# Altium schematic sheet UBX_NORA_B1_SCHEM_0002_Power.SchDoc
size A3; Date: 7/24/2020; CompanyName: U-blox; DrawnBy: EMOO; Engineer: EMOO; Organization: U-blox; Address1: 3950 Fairview Industrial Dr SE #100; Address2: Salem, OR 97302; SheetNumber: 2; SheetTotal: 6; SheetSize: B; SheetTitle: Power
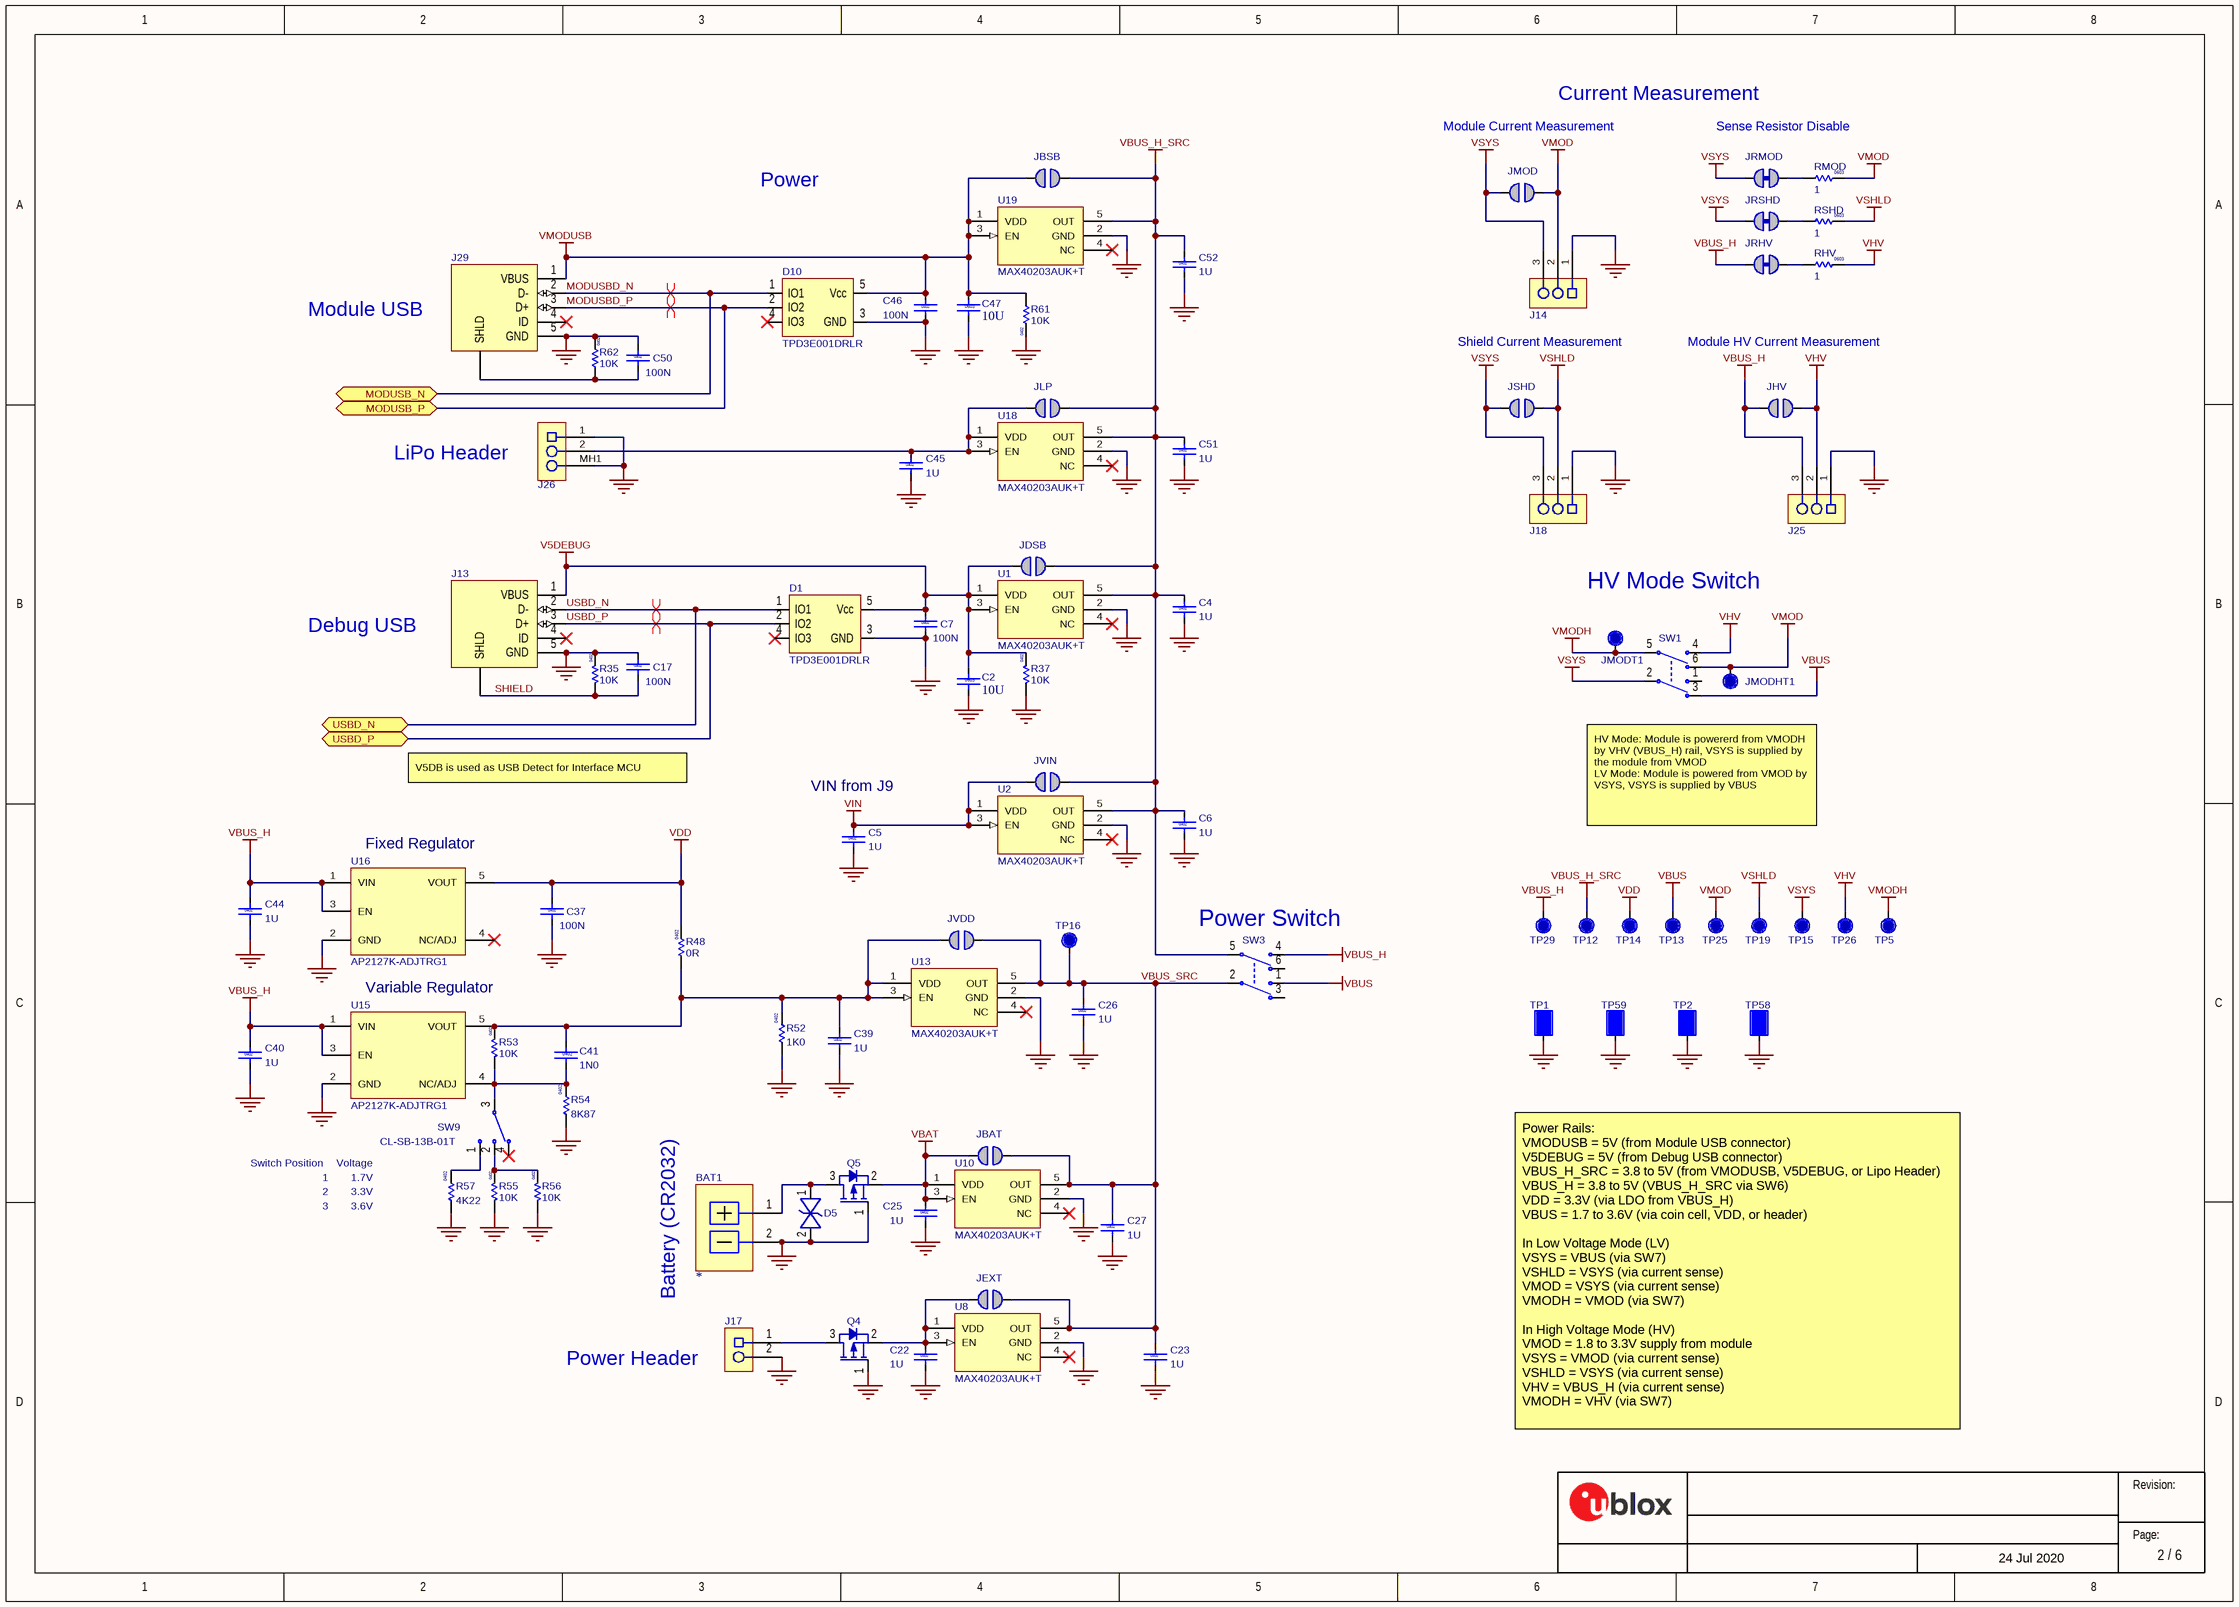
[diagram p0: UBX_NORA_B1_SCHEM_0002_Power.SchDoc]

## Parts
BAT1  (no value)  [Battery_S8211-46R_large]
C2  value 10U  Size: 0603  [CAP 0603 HD]
C4  value 1U  Size: 0402  [Cap 0402 HD]
C5  value 1U  Size: 0402  [Cap 0402 HD]
C6  value 1U  Size: 0402  [Cap 0402 HD]
C7  value 100N  Size: 0402  [Cap 0402 HD]
C17  value 100N  Size: 0402  [Cap 0402 HD]
C22  value 1U  Size: 0402  [Cap 0402 HD]
C23  value 1U  Size: 0402  [Cap 0402 HD]
C25  value 1U  Size: 0402  [Cap 0402 HD]
C26  value 1U  Size: 0402  [Cap 0402 HD]
C27  value 1U  Size: 0402  [Cap 0402 HD]
C37  value 100N  Size: 0402  [Cap 0402 HD]
C39  value 1U  Size: 0402  [Cap 0402 HD]
C40  value 1U  Size: 0402  [Cap 0402 HD]
C41  value 1N0  Size: 0402  [Cap 0402 HD]
C44  value 1U  Size: 0402  [Cap 0402 HD]
C45  value 1U  Size: 0402  [Cap 0402 HD]
C46  value 100N  Size: 0402  [Cap 0402 HD]
C47  value 10U  Size: 0603  [CAP 0603 HD]
C50  value 100N  Size: 0402  [Cap 0402 HD]
C51  value 1U  Size: 0402  [Cap 0402 HD]
C52  value 1U  Size: 0402  [Cap 0402 HD]
D1  Manufacturer P/N: TPD3E001DRLR  [SOT-553]
D5  (no value)  [SOD-923]
D10  Manufacturer P/N: TPD3E001DRLR  [SOT-553]
J13  (no value)  [USB_MICRO_RA_W-2TABS]
J14  (no value)  [HDR-0.1P-3Pin-1Row-SMT]
J17  (no value)  [HDR-0.1P-2PIN-TH]
J18  (no value)  [HDR-0.1P-3Pin-1Row-SMT]
J25  (no value)  [HDR-0.1P-3Pin-1Row-SMT]
J26  (no value)  [B2B-PH-SM4-TB]
J29  (no value)  [USB_MICRO_RA_W-2TABS]
JBAT  (no value)  [Solderbridge-Open]  (no BOM)
JBSB  (no value)  [Solderbridge-Open]  (no BOM)
JDSB  (no value)  [Solderbridge-Open]  (no BOM)
JEXT  (no value)  [Solderbridge-Open]  (no BOM)
JHV  (no value)  [Solderbridge-Open]  (no BOM)
JLP  (no value)  [Solderbridge-Open]  (no BOM)
JMOD  (no value)  [Solderbridge-Open]  (no BOM)
JMODHT1  TP  [TP10R]  (value not drawn)  (no BOM)
JMODT1  TP  [TP10R]  (value not drawn)  (no BOM)
JRHV  (no value)  [Solderbridge-Short]  (net tie, no BOM)
JRMOD  (no value)  [Solderbridge-Short]  (net tie, no BOM)
JRSHD  (no value)  [Solderbridge-Short]  (net tie, no BOM)
JSHD  (no value)  [Solderbridge-Open]  (no BOM)
JVDD  (no value)  [Solderbridge-Open]  (no BOM)
JVIN  (no value)  [Solderbridge-Open]  (no BOM)
Q4  (no value)  [SOT-523]
Q5  (no value)  [SOT-523]
R35  value 10K  Size: 0402  [RES 0402 HD]
R37  value 10K  Size: 0402  [RES 0402 HD]
R48  value 0R  Size: 0402  [RES 0402 HD]
R52  value 1K0  Size: 0402  [RES 0402 HD]
R53  value 10K  Size: 0402  [RES 0402 HD]
R54  value 8K87  Size: 0402  [RES 0402 HD]
R55  value 10K  Size: 0402  [RES 0402 HD]
R56  value 10K  Size: 0402  [RES 0402 HD]
R57  value 4K22  Size: 0402  [RES 0402 HD]
R61  value 10K  Size: 0402  [RES 0402 HD]
R62  value 10K  Size: 0402  [RES 0402 HD]
RHV  value 1  Size: 0603  [RES_0603_1700Lx950Wx600H_600x1000Pad_800G_FLX]
RMOD  value 1  Size: 0603  [RES_0603_1700Lx950Wx600H_600x1000Pad_800G_FLX]
RSHD  value 1  Size: 0603  [RES_0603_1700Lx950Wx600H_600x1000Pad_800G_FLX]
SW1  (no value)  [SW_Slide_DPDT_JS202011SCQN]
SW3  (no value)  [SW_Slide_DPDT_JS202011SCQN]
SW9  UBXH19-0000039  [CL-SB-13B-01T]  (value not drawn)
TP1  (no value)  [TP4.5x3Sq]  (no BOM)
TP2  (no value)  [TP4.5x3Sq]  (no BOM)
TP5  TP  [TP12R]  (value not drawn)  (no BOM)
TP12  TP  [TP12R]  (value not drawn)  (no BOM)
TP13  TP  [TP12R]  (value not drawn)  (no BOM)
TP14  TP  [TP12R]  (value not drawn)  (no BOM)
TP15  TP  [TP12R]  (value not drawn)
TP16  TP  [TP10R]  (value not drawn)  (no BOM)
TP19  TP  [TP12R]  (value not drawn)  (no BOM)
TP25  TP  [TP12R]  (value not drawn)  (no BOM)
TP26  TP  [TP12R]  (value not drawn)  (no BOM)
TP29  TP  [TP12R]  (value not drawn)  (no BOM)
TP58  (no value)  [TP4.5x3Sq]  (no BOM)
TP59  (no value)  [TP4.5x3Sq]  (no BOM)
U1  Manufacturer Part Number 1: MAX40203AUK+T  [SOT-23-5_2]
U2  Manufacturer Part Number 1: MAX40203AUK+T  [SOT-23-5_2]
U8  Manufacturer Part Number 1: MAX40203AUK+T  [SOT-23-5_2]
U10  Manufacturer Part Number 1: MAX40203AUK+T  [SOT-23-5_2]
U13  Manufacturer Part Number 1: MAX40203AUK+T  [SOT-23-5_2]
U15  Manufacturer Part Number 1: AP2127K-ADJTRG1  [SOT-23-5_3D_Body_Fix]  (hidden comment: UBXH12-0000547)
U16  Manufacturer Part Number 1: AP2127K-ADJTRG1  [SOT-23-5_3D_Body_Fix]  (hidden comment: UBXH12-0000546)
U18  Manufacturer Part Number 1: MAX40203AUK+T  [SOT-23-5_2]
U19  Manufacturer Part Number 1: MAX40203AUK+T  [SOT-23-5_2]

## Ports
MODUSB_N (bidir), MODUSB_P (bidir), USBD_N (bidir), USBD_P (bidir)

## Nets
GND: BAT1.2 C2.2 C4.2 C5.2 C6.2 C7.2 C17.1 C22.2 C23.2 C25.2 C26.2 C27.2 C37.2 C39.2 C40.2 C44.2 C45.2 C46.2 C47.2 C50.1 C51.2 C52.2 D1.3(GND) D5.2 D10.3(GND) J13.5(GND) J14.1 J17.2 J18.1 J25.1 J26.1 J26.MH1 J29.5(GND) Q4.1(G) Q5.1(G) R35.2 R37.1 R52.1 R54.1 R55.1 R56.1 R57.1 R61.2 R62.2 TP1.1 TP2.1 TP58.1 TP59.1 U1.2(GND) U2.2(GND) U8.2(GND) U10.2(GND) U13.2(GND) U15.2(GND) U16.2(GND) U18.2(GND) U19.2(GND)
V5DEBUG: C2.1 C7.1 D1.5(Vcc) J13.1(VBUS) JDSB.2 R37.2 U1.1(VDD) U1.3(EN)
VBAT: C25.1 JBAT.2 Q5.2(S) U10.1(VDD) U10.3(EN)
VBUS: SW1.3(N.C-1) SW3.1(N.O-1) TP13.1
VBUS_H: C40.1 C44.1 J25.3 JHV.2 JRHV.2 SW3.4(N.O-2) TP29.1 U15.1(VIN) U15.3(EN) U16.1(VIN) U16.3(EN)
VBUS_H_SRC: C4.1 C6.1 C51.1 C52.1 JBSB.1 JDSB.1 JLP.1 JVIN.1 SW3.5(COM-2) TP12.1 U1.5(OUT) U2.5(OUT) U18.5(OUT) U19.5(OUT)
VDD: C37.1 R48.2 TP14.1 U16.5(VOUT)
VHV: J25.2 JHV.1 RHV.2 SW1.4(N.O-2) TP26.1
VIN: C5.1 JVIN.2 U2.1(VDD) U2.3(EN)
VMOD: J14.2 JMOD.1 JMODHT1.1 RMOD.2 SW1.6(N.C-2) TP25.1
VMODH: JMODT1.1 SW1.5(COM-2) TP5.1
VMODUSB: C46.1 C47.1 D10.5(Vcc) J29.1(VBUS) JBSB.2 R61.1 U19.1(VDD) U19.3(EN)
VSHLD: J18.2 JSHD.1 RSHD.2 TP19.1
VSYS: J14.3 J18.3 JMOD.2 JRMOD.2 JRSHD.2 JSHD.2 SW1.2(COM-1) TP15.1
MODUSBD_N: D10.1(IO1) J29.2(D-) ; port MODUSB_N
MODUSBD_P: D10.2(IO2) J29.3(D+) ; port MODUSB_P
SHIELD: C17.2 J13.6(SHLD) R35.1
USBD_N: D1.1(IO1) J13.2(D-) ; port USBD_N
USBD_P: D1.2(IO2) J13.3(D+) ; port USBD_P
VBUS_SRC: C23.1 C26.1 C27.1 JBAT.1 JEXT.1 JVDD.1 SW3.2(COM-1) TP16.1 U8.5(OUT) U10.5(OUT) U13.5(OUT)
NetBAT1_1: BAT1.1 D5.1 Q5.3(D)
NetC22_1: C22.1 JEXT.2 Q4.2(S) U8.1(VDD) U8.3(EN)
NetC39_1: C39.1 C41.1 JVDD.2 R48.1 R52.2 R53.2 U13.1(VDD) U13.3(EN) U15.5(VOUT)
NetC41_2: C41.2 R53.1 R54.2 SW9.3(COM) U15.4(NC/ADJ)
NetC45_1: C45.1 J26.2 JLP.2 U18.1(VDD) U18.3(EN)
NetC50_2: C50.2 J29.6(SHLD) R62.1
NetJ17_1: J17.1 Q4.3(D)
NetJRHV_1: JRHV.1 RHV.1
NetJRMOD_1: JRMOD.1 RMOD.1
NetJRSHD_1: JRSHD.1 RSHD.1
NetR55_2: R55.2 R56.2 SW9.2(N.O-2)
NetR57_2: R57.2 SW9.1(N.O-1)

Not connected (* = marked no-connect by the designer): D1 4(IO3)*; D10 4(IO3)*; J13 4(ID)*; J29 4(ID)*; SW1 1(N.O-1); SW3 3(N.C-1) 6(N.C-2); SW9 4(N.O.-3)*; U1 4(NC)*; U2 4(NC)*; U8 4(NC)*; U10 4(NC)*; U13 4(NC)*; U16 4(NC/ADJ)*; U18 4(NC)*; U19 4(NC)*

## Layout directives
differential pair; net class USB_DIFF: MODUSBD_N, MODUSBD_P, USBD_N, USBD_P

## Notes on the sheet
- Current Measurement
- Power
- Module Current Measurement
- Sense Resistor Disable
- Module USB
- Shield Current Measurement
- Module HV Current Measurement
- LiPo Header
- HV Mode Switch
- Debug USB
- V5DB is used as USB Detect for Interface MCU
- (near C5) VIN from J9
- HV Mode: Module is powererd from VMODH by VHV (VBUS_H) rail, VSYS is supplied by the module from VMOD
  LV Mode: Module is powered from VMOD by VSYS, VSYS is supplied by VBUS
- (near U16) Fixed Regulator
- (near SW3) Power Switch
- Variable Regulator
- Switch Position
- 1
- 2
- Voltage
- 1.7V
- 3.3V
- 3
- 3.6V
- Battery (CR2032)
- Power Header
- Power Rails:
  VMODUSB = 5V (from Module USB connector)
  V5DEBUG = 5V (from Debug USB connector)
  VBUS_H_SRC = 3.8 to 5V (from VMODUSB, V5DEBUG, or Lipo Header)
  VBUS_H = 3.8 to 5V (VBUS_H_SRC via SW6)
  VDD = 3.3V (via LDO from VBUS_H)
  VBUS = 1.7 to 3.6V (via coin cell, VDD, or header)
  In Low Voltage Mode (LV)
  VSYS = VBUS (via SW7)
  VSHLD = VSYS (via current sense)
  VMOD = VSYS (via current sense)
  VMODH = VMOD (via SW7)
  In High Voltage Mode (HV)
  VMOD = 1.8 to 3.3V supply from module
  VSYS = VMOD (via current sense)
  VSHLD = VSYS (via current sense)
  VHV = VBUS_H (via current sense)
  VMODH = VHV (via SW7)
- 24 Jul 2020
- Revision:
- Page:

## Library data of the parts
BAT1 = UBXH03-0000010: BATTERY HOLDER COIN SMT CR2016 CR2020 CR2025 CR2032 HARWIN S8211-46R; Editor: eric.moog; Env: ROHS; Permitted Use: Support Products; Perferred: PREF; Manufacturer P/N: *; Part Number: UBXH03-0000010; Min Operating Temp: -40°C; Max Operating Temp: 105°C; Part Type: Battery; UBX Wiki: https://wiki.u-blox.com/bin/view/Operations/PartDetails?index=38906; RefDes: BT
C2 C47 = UBXH01-0000040: CAP CER X5R 0603 10U 20% 10V; Manufacturer: Taiyo Yuden Company, Ltd.; Manufacturer P/N: LMK107BBJ106MALT; Editor: pierpaolo.arban; Released by: matej.budin; Env: ROHS; Permitted Use: Volume Products; Perferred: PREF; Mfg P/N Status: Active; Mfg P/N Split: 100; Mfg P/N Released: Yes; Part Number: UBXH01-0000040; Tolerance: 20%; Max Voltage: 10V; Part Type: Capacitor; Release Data: 2013-01-10T11:54:39; UBX Wiki: https://wiki.u-blox.com/bin/view/Operations/PartDetails?index=16909; RefDes: C; Mfg P/N Datasheet: https://wiki.u-blox.com/bin/view/Generic/Docs/DocumentSummary?index=16905; Manufacturer 2: Murata Manufacturing Company, Ltd.; Manufacturer P/N 2: GRM188R61A106KAAL; Mfg P/N Status 2: Active; Mfg P/N Split 2: 0; Mfg P/N Released 2: Yes; Mfg P/N Datasheet 2: https://wiki.u-blox.com/bin/view/Generic/Docs/DocumentSummary?index=27232; Manufacturer 3: Taiyo Yuden Company, Ltd.; Manufacturer P/N 3: LMK107BJ106MALTD; Mfg P/N Status 3: NRND; Mfg P/N Split 3: 0; Mfg P/N Released 3: Yes; Mfg P/N Datasheet 3: https://wiki.u-blox.com/bin/view/Generic/Docs/DocumentSummary?index=29392
C4-C6 C22 C23 C25-C27 C39 C40 C44 C45 C51 C52 = UBXH01-0000248: CAP CER X5R 0402 1U 10% 10V; Manufacturer: Murata Manufacturing Company, Ltd.; Manufacturer P/N: GRM155R61C105KA12; Editor: michael.hein; Released by: igor.shevchenko; Env: ROHS; Permitted Use: Volume Products; Perferred: PREF; Mfg P/N Status: Active; Mfg P/N Split: 100; Mfg P/N Released: Yes; Part Number: UBXH01-0000248; Tolerance: 10%; Max Voltage: 10V; Min Operating Temp: -40°C; Max Operating Temp: 85°C; Part Type: Capacitor; Release Data: 2016-03-16T11:26:35; UBX Wiki: https://wiki.u-blox.com/bin/view/Operations/PartDetails?index=24378; RefDes: C; Mfg P/N Datasheet: https://wiki.u-blox.com/bin/view/Generic/Docs/DocumentSummary?index=29581; Manufacturer 2: TDK Corporation; Manufacturer P/N 2: C1005X5R1E105K050BC; Mfg P/N Status 2: Active; Mfg P/N Split 2: 0; Mfg P/N Released 2: Yes; Mfg P/N Datasheet 2: https://wiki.u-blox.com/bin/view/Generic/Docs/DocumentSummary?index=28058; Manufacturer 3: Samsung Electro-Mechanics; Manufacturer P/N 3: CL05A105KA5NQNC; Mfg P/N Status 3: Active; Mfg P/N Split 3: 0; Mfg P/N Released 3: Yes; Mfg P/N Datasheet 3: https://wiki.u-blox.com/bin/view/Generic/Docs/DocumentSummary?index=28056
C7 C17 C37 C46 C50 = UBXH01-2021002: CAP CER X5R 0402 100N 10% 10V; Manufacturer: Murata Manufacturing Company, Ltd.; Manufacturer P/N: GRM155R61A104KA01; Editor: roland.rust; Env: GREEN; Permitted Use: Volume Products; Perferred: PREF; Mfg P/N Status: NRND; Mfg P/N Split: 100; Mfg P/N Released: Yes; Part Number: UBXH01-2021002; Tolerance: 10%; Max Voltage: 10V; Part Type: Capacitor; Released by: roland.rust; Release Data: 2005-07-22T13:59:44; UBX Wiki: https://wiki.u-blox.com/bin/view/Operations/PartDetails?index=5759; RefDes: C; Manufacturer 2: Samsung Electro-Mechanics; Manufacturer P/N 2: CL05A104KP5NNN; Mfg P/N Status 2: Active; Mfg P/N Split 2: 0; Mfg P/N Released 2: Yes; Mfg P/N Datasheet 2: https://wiki.u-blox.com/bin/view/Generic/Docs/DocumentSummary?index=28113
C41 = UBXH01-0000013: CAP CER X7R 0402 1N0 10% 50V; Manufacturer: Murata Manufacturing Company, Ltd.; Manufacturer P/N: GRM155R71H102KA01; Editor: massimo.vlacci; Released by: dario.antonaz; Env: ROHS; Permitted Use: Volume Products; Perferred: PREF; Mfg P/N Status: NRND; Mfg P/N Split: 100; Mfg P/N Released: Yes; Part Number: UBXH01-0000013; Tolerance: 10%; Max Voltage: 50V; Part Type: Capacitor; Release Data: 2015-04-23T14:26:43; UBX Wiki: https://wiki.u-blox.com/bin/view/Operations/PartDetails?index=8466; RefDes: C; Mfg P/N Datasheet: https://wiki.u-blox.com/bin/view/Generic/Docs/DocumentSummary?index=22572
D1 D10 = UBXH07-0000086: TVS DIODE 5.5VWM; Manufacturer: Texas Instruments; Value: TPD3E001DRLR; Editor: hozaifa.abdelgadir; Env: GREEN; Permitted Use: Support Products; Perferred: PREF; Mfg P/N Status: Active; Mfg P/N Split: 100; Mfg P/N Released: No; Part Number: UBXH07-0000086; Min Operating Temp: -40°C; Max Operating Temp: 85°C; Part Type: Diode; UBX Wiki: https://wiki.u-blox.com/bin/view/Operations/PartDetails?index=38374; RefDes: D; Mfg P/N Datasheet: https://wiki.u-blox.com/bin/view/Generic/Docs/DocumentSummary?index=38197
D5 = UBXH07-0000034: ESD PROTECTION DIODE ULTRA LOW LEAKAGE SOD923 ON SEMI 3V3; Manufacturer: ON Semiconductor; Manufacturer P/N: ESD9R3.3ST5G; Editor: pierpaolo.arban; Released by: dario.antonaz; Env: ROHS; Permitted Use: Support Products; Perferred: PREF; Mfg P/N Status: Active; Mfg P/N Split: 100; Mfg P/N Released: Yes; Part Number: UBXH07-0000034; Value: 3V3; Part Type: Diode; Release Data: 2015-04-23T14:51:11; UBX Wiki: https://wiki.u-blox.com/bin/view/Operations/PartDetails?index=22447; RefDes: D; Mfg P/N Datasheet: https://wiki.u-blox.com/bin/view/Generic/Docs/DocumentSummary?index=22449
J13 J29 = UBXH04-0000804: CONN RECEPTACLE USB MICRO B 5-PIN SMD TH RA 5.5V 1.8A; Manufacturer: Amphenol Commercial Products (Amphenol ICC); Value: 10118193-0001LF; Editor: eric.moog; Env: ROHS; Permitted Use: Support Products; Mfg P/N Status: Active; Mfg P/N Split: 100; Mfg P/N Released: No; Part Number: UBXH04-0000804; Max Voltage: 5.5V; Max Current: 1.8A; Min Operating Temp: -30°C; Max Operating Temp: 85°C; Part Type: Connector; UBX Wiki: https://wiki.u-blox.com/bin/view/Operations/PartDetails?index=38944; Perferred: N/A; RefDes: J; Manufacturer P/N: 10118193-0001LF; Mfg P/N Datasheet: https://wiki.u-blox.com/bin/view/Generic/Docs/DocumentSummary?index=38943
J14 J18 J25 = UBXH04-0000792: 1-ROW SMD CONN 100MIL GRID 3 -PIN 100V 3A; Manufacturer P/N: M20-8770342; Manufacturer: HARWiN; Value: M20-8770342; Editor: eric.moog; Env: ROHS; Permitted Use: Support Products; Mfg P/N Status: Active; Mfg P/N Split: 100; Mfg P/N Released: No; Part Number: UBXH04-0000792; Max Voltage: 100V; Max Current: 3A; Min Operating Temp: -40°C; Max Operating Temp: 105°C; Part Type: Connector; UBX Wiki: https://wiki.u-blox.com/bin/view/Operations/PartDetails?index=38569; Perferred: N/A; RefDes: J; Mfg P/N Datasheet: https://wiki.u-blox.com/bin/view/Generic/Docs/DocumentSummary?index=28457
J17 = UBXH04-0000026: 1-ROW TH-PCB SOCKETS 100MIL GRID 2-PIN 0.64MM SQUARE POLARIZE; Manufacturer P/N: M20-9990245; Manufacturer: HARWiN; Value: M20-9990245; Editor: roland.rust; Released by: alvaro.nussbaum; Env: ROHS; Permitted Use: Internal Use; Perferred: PREF; Mfg P/N Status: Active; Mfg P/N Split: 100; Mfg P/N Released: Yes; Part Number: UBXH04-0000026; Part Type: Connector; Release Data: 2015-06-04T16:45:09; UBX Wiki: https://wiki.u-blox.com/bin/view/Operations/PartDetails?index=10937; RefDes: J
J26 = UBXH04-0000791: CONN 1-ROW SMT 2.0MM GRID 2-PIN VERT 100V 2A; Part Name: Conn, SMT, 0.079" Pitch, 2 Pin, Vert, Black; Manufacturer: JST; Item Phase: In Production; Use in new designs: Yes; Voltage: None; Value: B2B-PH-SM4-TB; Editor: eric.moog; Env: ROHS; Permitted Use: Support Products; Mfg P/N Status: Active; Mfg P/N Split: 100; Mfg P/N Released: No; Part Number: UBXH04-0000791; Manufacturer Part Number 1: B2B-PH-SM4-TB; Supplier 1: None; Supplier Part Number 1: None; Diameter: None; Height: 6.5mm; Max Operating Temp: 85°C; Min Operating Temp: -30°C; Pins: 2; Revision: 0A; UBX Code: None; Manufacturer 2: None; Manufacturer Part Number 2: None; Supplier 2: None; Supplier Part Number 2: None; Manufacturer P/N: B2B-PH-SM4-TB; Max Voltage: 100V; Max Current: 2A; Part Type: Connector; UBX Wiki: https://wiki.u-blox.com/bin/view/Operations/PartDetails?index=38567; Perferred: N/A; RefDes: J; Mfg P/N Datasheet: https://wiki.u-blox.com/bin/view/Generic/Docs/DocumentSummary?index=35463
JBAT JBSB JDSB JEXT JHV JLP JMOD JSHD JVDD JVIN = UBXH00-0000082: SOLDERBRIDGE-OPEN; Editor: aneeb.sohail; Env: GREEN; Permitted Use: Volume Products; Perferred: PREF; Part Number: UBXH00-0000082; Min Operating Temp: -55°C; Max Operating Temp: 155°C; Part Type: Connector; UBX Wiki: https://wiki.u-blox.com/bin/view/Operations/PartDetails?index=36361; RefDes: J
JMODHT1 JMODT1 TP16 = UBXH00-0000096: TESTPOINT 1MM CIRCULAR; Editor: eric.moog; Permitted Use: Volume Products; Perferred: PREF; Part Number: UBXH00-0000096; Min Operating Temp: -55°C; Max Operating Temp: 125°C; Part Type: Testpoint; UBX Wiki: https://wiki.u-blox.com/bin/view/Operations/PartDetails?index=38784; Env: N/A; RefDes: TP
JRHV JRMOD JRSHD = UBXH00-0000084: SOLDERBRIDGE-SHORT; Editor: aneeb.sohail; Env: GREEN; Permitted Use: Volume Products; Perferred: PREF; Part Number: UBXH00-0000084; Min Operating Temp: -55°C; Max Operating Temp: 155°C; Part Type: Connector; UBX Wiki: https://wiki.u-blox.com/bin/view/Operations/PartDetails?index=36363; RefDes: J
Q4 Q5 = UBXH20-0000087: P-CHANNEL MOSFET DIODES SOT-523 DMG1013T-7 20V 460mA; Editor: eric.moog; Env: ROHS; Permitted Use: Volume Products; Perferred: PREF; Part Number: UBXH20-0000087; Max Voltage: 20V; Max Current: 460mA; Min Operating Temp: -55°C; Max Operating Temp: 155°C; Part Type: Transistor; UBX Wiki: https://wiki.u-blox.com/bin/view/Operations/PartDetails?index=38920; RefDes: Q
R35 R37 R53 R55 R56 R61 R62 = UBXH18-0000065: RES THICK FILM CHIP 0402 10K 1% 63mW; Manufacturer: KOA; Manufacturer P/N: RK73H1ETTP1002F; Editor: erian.bezhani; Released by: massimo.vlacci; Env: ROHS; Permitted Use: Volume Products; Perferred: PREF; Mfg P/N Status: Active; Mfg P/N Split: 100; Mfg P/N Released: Yes; Part Number: UBXH18-0000065; Tolerance: 1%; Max Power: 63mW; Part Type: Resistor; Release Data: 2012-06-08T18:02:21; UBX Wiki: https://wiki.u-blox.com/bin/view/Operations/PartDetails?index=16837; RefDes: R; Mfg P/N Datasheet: https://wiki.u-blox.com/bin/view/Generic/Docs/DocumentSummary?index=8222
R48 = UBXH18-0003002: RES THICK FILM CHIP 0402 0R 0 100mW; Manufacturer: KOA; Manufacturer P/N: RK73Z1ETTD; Tolerance: 0; Editor: charlotte.biber; Released by: peter.mueller; Env: ROHS; Permitted Use: Volume Products; Perferred: PREF; Mfg P/N Status: NRND; Mfg P/N Split: 100; Mfg P/N Released: Yes; Part Number: UBXH18-0003002; Max Power: 100mW; Part Type: Resistor; Release Data: 2012-06-05T09:49:55; UBX Wiki: https://wiki.u-blox.com/bin/view/Operations/PartDetails?index=6611; RefDes: R; Manufacturer 2: YAGEO; Manufacturer P/N 2: 2322_705_91001_L; Mfg P/N Status 2: NRND; Mfg P/N Split 2: 0; Mfg P/N Released 2: Yes
R52 = UBXH18-0008049: RES THICK FILM CHIP 0402 1K0 5% 100mW; Manufacturer: YAGEO; Manufacturer P/N: 2322_705_70102_L; Editor: roland.rust; Env: ROHS; Permitted Use: Volume Products; Perferred: PREF; Mfg P/N Status: Obsolete; Mfg P/N Split: 100; Mfg P/N Released: Yes; Part Number: UBXH18-0008049; Tolerance: 5%; Max Power: 100mW; Part Type: Resistor; Released by: roland.rust; Release Data: 2005-07-22T13:59:44; UBX Wiki: https://wiki.u-blox.com/bin/view/Operations/PartDetails?index=6939; RefDes: R; Manufacturer 2: KOA; Manufacturer P/N 2: RK73B1ETTD102J; Mfg P/N Status 2: NRND; Mfg P/N Split 2: 0; Mfg P/N Released 2: Yes
R54 = UBXH18-0000568: RES THICK FILM CHIP 0402 8K87 8K87 1% 63mW; Manufacturer: KOA; Manufacturer P/N: RK73H1ETTP8871F; Editor: eric.moog; Env: ROHS; Permitted Use: Volume Products; Perferred: PREF; Mfg P/N Status: Active; Mfg P/N Split: 100; Mfg P/N Released: No; Part Number: UBXH18-0000568; Tolerance: 1%; Max Power: 63mW; Min Operating Temp: -55°C; Max Operating Temp: 155°C; Part Type: Resistor; UBX Wiki: https://wiki.u-blox.com/bin/view/Operations/PartDetails?index=38916; RefDes: R; Mfg P/N Datasheet: https://wiki.u-blox.com/bin/view/Generic/Docs/DocumentSummary?index=8222
R57 = UBXH18-0000569: RES THICK FILM CHIP 0402 4K22 4K22 1% 63mW; Manufacturer: KOA; Manufacturer P/N: RK73H1ETTP4221F; Editor: eric.moog; Env: ROHS; Permitted Use: Volume Products; Perferred: PREF; Mfg P/N Status: Active; Mfg P/N Split: 100; Mfg P/N Released: No; Part Number: UBXH18-0000569; Tolerance: 1%; Max Power: 63mW; Min Operating Temp: -55°C; Max Operating Temp: 155°C; Part Type: Resistor; UBX Wiki: https://wiki.u-blox.com/bin/view/Operations/PartDetails?index=38918; RefDes: R; Mfg P/N Datasheet: https://wiki.u-blox.com/bin/view/Generic/Docs/DocumentSummary?index=8222
RHV RMOD RSHD = UBXH18-0000555: RES THICK FILM CHIP 0603 200PPM/C 0.1W 1 1% 100mW; Manufacturer: Bourns; Manufacturer P/N: CR0603-F/-1R00ELF; Editor: mikhail.sialitski; Released by: gianni.falleroni; Env: ROHS; Permitted Use: Support Products; Mfg P/N Status: Active; Mfg P/N Split: 100; Mfg P/N Released: Yes; Part Number: UBXH18-0000555; Tolerance: 1%; Max Power: 100mW; Min Operating Temp: -55°C; Max Operating Temp: 155°C; Part Type: Resistor; Release Data: 2023-02-01T14:11:03; UBX Wiki: https://wiki.u-blox.com/bin/view/Operations/PartDetails?index=37924; Perferred: N/A; RefDes: R; Mfg P/N Datasheet: https://wiki.u-blox.com/bin/view/Generic/Docs/DocumentSummary?index=37926
SW1 SW3 = UBXH19-0000050: 2 WAY ON-ON SUB-MINIATURE SLIDE SWITCH SMD JS SERIES; Manufacturer P/N: JS202011SCQN; Manufacturer: C&K Components; Value: JS202011SCQN; Editor: andre.pick; Released by: martin.pilik; Env: ROHS; Permitted Use: Support Products; Perferred: PREF; Mfg P/N Status: Active; Mfg P/N Split: 100; Mfg P/N Released: Yes; Part Number: UBXH19-0000050; Min Operating Temp: -40°C; Max Operating Temp: 85°C; Part Type: Switch; Release Data: 2022-06-09T16:59:15; UBX Wiki: https://wiki.u-blox.com/bin/view/Operations/PartDetails?index=36899; RefDes: S; Mfg P/N Datasheet: https://wiki.u-blox.com/bin/view/Generic/Docs/DocumentSummary?index=16625
SW9 = UBXH19-0000039: 3-WAY SLIDE SMD SWITCH SP3T; Part Name: SWITCH SLIDE SP3T 300MA 6V SMD; Manufacturer: Nidec Copal Electronics; Item_Phase: Preliminary; Component Mounting Type: SMT; Current: 200mA; Switch/Button Function: On-On-On; Use in new designs: Yes; Voltage: 12V; Value: CL-SB-13B-01T; Editor: evgenii.platonov; Env: ROHS; Permitted Use: Support Products; Perferred: PREF; Mfg P/N Status: Active; Mfg P/N Split: 100; Mfg P/N Released: No; Part Number: UBXH19-0000039; Part_Type: Switch; Supplier 1: Digi-Key; Supplier Part Number 1: 563-1330-2-ND; Color: Silver; Height: 5.5mm; Length: 12mm; Pins: 4; Switch/Button Circuit: SP3T; Width: 3.5mm; Manufacturer P/N: CL-SB-13B-01T; Min Operating Temp: -40°C; Max Operating Temp: 85°C; Part Type: Switch; UBX Wiki: https://wiki.u-blox.com/bin/view/Operations/PartDetails?index=33526; RefDes: S; Mfg P/N Datasheet: https://wiki.u-blox.com/bin/view/Generic/Docs/DocumentSummary?index=33528
TP1 TP2 TP58 TP59 = UBXH00-0000097: TESTPOINT 3MMX4.5MM RECTANGULAR NO SILKSCREEN; Editor: eric.moog; Permitted Use: Volume Products; Part Number: UBXH00-0000097; Min Operating Temp: -55°C; Max Operating Temp: 125°C; Part Type: Testpoint; UBX Wiki: https://wiki.u-blox.com/bin/view/Operations/PartDetails?index=38793; Env: N/A; Perferred: N/A; RefDes: TP
TP5 TP12-TP14 TP19 TP25 TP26 TP29 = UBXH00-0000102: TESTPOINT 1.2MM CIRCULAR W/ SILKSCREEN; Editor: eric.moog; Permitted Use: Support Products; Perferred: PREF; Part Number: UBXH00-0000102; Min Operating Temp: -55°C; Max Operating Temp: 155°C; Part Type: Testpoint; UBX Wiki: https://wiki.u-blox.com/bin/view/Operations/PartDetails?index=38966; Env: N/A; RefDes: TP
TP15 = UBXH00-0000102: TESTPOINT 1.2MM CIRCULAR; Editor: eric.moog; Permitted Use: Support Products; Perferred: PREF; Part Number: UBXH00-0000102; Min Operating Temp: -55°C; Max Operating Temp: 155°C; Part Type: Testpoint; UBX Wiki: https://wiki.u-blox.com/bin/view/Operations/PartDetails?index=38966; Env: N/A; RefDes: TP
U1 U2 U8 U10 U13 U18 U19 = UBXH12-0000539: IDEAL DIODE OR CONTROLLER SOURCE SELECTOR SWITCH P-CHANNEL 1:1 SOT-23-5 5.5V 1A; Part Name: IC IDEAL DIODE LDO 1.2-5.5V 1.0A SOT-23-5; Manufacturer 1: Maxim; Item_Phase: Preliminary; Body Size: 2.8mm x 2.9mm; Component Mounting Type: SMT; Current: 1.0A; SMT Pitch: 0.95mm; Use in new designs: Yes; Value: MAX40203AUK+T; Editor: eric.moog; Env: ROHS; Permitted Use: Support Products; Mfg P/N Status: Active; Mfg P/N Split: 100; Mfg P/N Released: No; Part Number: UBXH12-0000539; Part_Type: Ideal Diode; Supplier 1: Digi-Key; Supplier Part Number 1: 175-MAX40203AUK+TTR-ND; Height: 1.25; MFG Package: SOT-23-5; Package Type: SOT-23-5; Pins: 5; Voltage: 5.5V; HelpURL: https://datasheets.maximintegrated.com/en/ds/MAX40203.pdf; Max Voltage: 5.5V; Max Current: 1A; Part Type: PMIC; UBX Wiki: https://wiki.u-blox.com/bin/view/Operations/PartDetails?index=38597; Perferred: N/A; RefDes: U; Manufacturer: Maxim; Manufacturer P/N: MAX40203AUK+T; Mfg P/N Datasheet: https://wiki.u-blox.com/bin/view/Generic/Docs/DocumentSummary?index=38598
U15 = UBXH12-0000547: LDO REGULATOR ADJ 3.3V 300MA AP2127 SOT-23-5 6V 300mA; Part Name: IC REG LDO ADJ 0.3A SOT23-5; Part_Type: Power Supply; Manufacturer 1: Diodes Incorporated; Item_Phase: Preliminary; Body Size: 1.7mm x 3.1mm; Component Mounting Type: SMT; Regulator Outputs: 1xLDO; SMT Pitch: 0.95mm; Use in new designs: Yes; Value: AP2127K-ADJTRG1; Editor: eric.moog; Env: ROHS; Permitted Use: Support Products; Perferred: PREF; Mfg P/N Status: Active; Mfg P/N Split: 100; Mfg P/N Released: No; Part Number: UBXH12-0000547; Supplier 1: Digi-Key; Supplier Part Number 1: AP2127K-ADJTRG1DITR-ND; Current: 300mA; Height: 1.45mm; MFG Package: SOT-23-5; Package Type: SOT; Pins: 5; Voltage: 6V; Max Voltage: 6V; Max Current: 300mA; Min Operating Temp: -40°C; Max Operating Temp: 85°C; Part Type: Regulator; UBX Wiki: https://wiki.u-blox.com/bin/view/Operations/PartDetails?index=38903; RefDes: U; Manufacturer: Diodes Incorporated; Manufacturer P/N: AP2127K-ADJTRG1; Mfg P/N Datasheet: https://wiki.u-blox.com/bin/view/Generic/Docs/DocumentSummary?index=38901
U16 = UBXH12-0000546: LDO REGULATOR FIX 3.3V 300MA AP2127 SOT-23-5 6V 300mA; Part Name: IC REG LDO ADJ 0.3A SOT23-5; Part_Type: Power Supply; Manufacturer 1: Diodes Incorporated; Item_Phase: Preliminary; Body Size: 1.7mm x 3.1mm; Component Mounting Type: SMT; Regulator Outputs: 1xLDO; SMT Pitch: 0.95mm; Use in new designs: Yes; Value: AP2127K-3.3TRG1; Editor: eric.moog; Env: ROHS; Permitted Use: Support Products; Perferred: PREF; Mfg P/N Status: Active; Mfg P/N Split: 100; Mfg P/N Released: No; Part Number: UBXH12-0000546; Supplier 1: Digi-Key; Supplier Part Number 1: AP2127K-ADJTRG1DITR-ND; Current: 300mA; Height: 1.45mm; MFG Package: SOT-23-5; Package Type: SOT; Pins: 5; Voltage: 6V; Max Voltage: 6V; Max Current: 300mA; Min Operating Temp: -40°C; Max Operating Temp: 85°C; Part Type: Regulator; UBX Wiki: https://wiki.u-blox.com/bin/view/Operations/PartDetails?index=38900; RefDes: U; Manufacturer: Diodes Incorporated; Manufacturer P/N: AP2127K-3.3TRG1; Mfg P/N Datasheet: https://wiki.u-blox.com/bin/view/Generic/Docs/DocumentSummary?index=38901